# Altium schematic sheet Receiver.SchDoc
size A4; SheetNumber: 1; SheetTotal: 1; SPICEModelCacheURACZJYY: <root> / <DocumentId>URACZJYY</DocumentId> / </root>
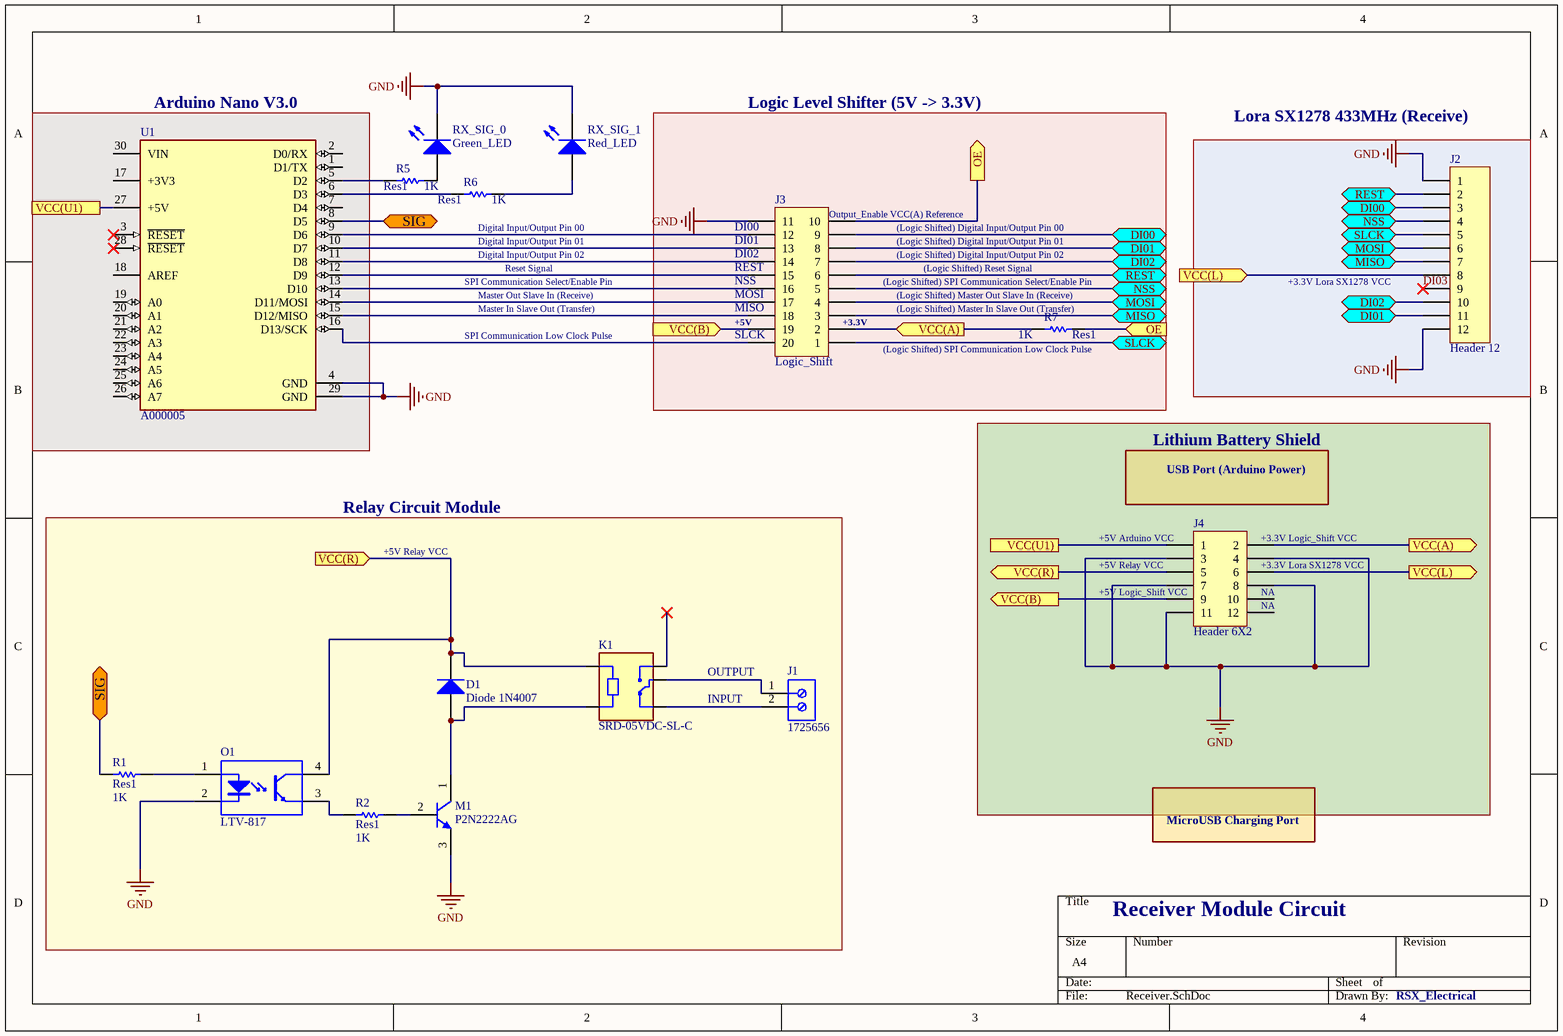
[diagram p0: Receiver.SchDoc]

## Parts
D1  Diode 1N4007  [DO-41]
J1  1725656  [PHOE-1725656-2]
J2  Header 12  [LORA Sx1278]
J3  Logic_Shift  [DIP2SSOP20]
J4  Header 6X2  [3.3V/5V Battery Shield]
K1  SRD-05VDC-SL-C  [RELAY_SRD-05VDC-SL-C]
M1  P2N2222AG  [ONSC-TO-92-3-29-11]
O1  LTV-817  [LTST-LTV-817-4]
R1  Res1  value 1K  [AXIAL-0.3]
R2  Res1  value 1K  [AXIAL-0.3]
R5  Res1  value 1K  [AXIAL-0.3]
R6  Res1  value 1K  [AXIAL-0.3]
R7  Res1  value 1K  [AXIAL-0.3]
RX_SIG_0  Green_LED  [LED-0]
RX_SIG_1  Red_LED  [LED-0]
U1  A000005  [FP-A000005-MFG]

## Blocks framed on the sheet
Arduino Nano V3.0: U1
Logic Level Shifter (5V -> 3.3V): J3 R7
Lora SX1278 433MHz (Receive): J2
Lithium Battery Shield: J4
Relay Circuit Module: D1 J1 K1 M1 O1 R1 R2

## Ports
DI00 (bidir), DI01 (bidir), DI02 (bidir), MISO (bidir), MOSI (bidir), NSS (bidir), OE (in), OE (out), REST (bidir), SIG (bidir), SLCK (bidir), VCC(A) (in), VCC(A) (out), VCC(B) (in), VCC(B) (out), VCC(L) (in), VCC(L) (out), VCC(R) (in), VCC(R) (out), VCC(U1)

## Nets
GND: J2.1 J2.12 J3.11 J4.3 J4.4 J4.7 J4.8 J4.11 M1.3(E) O1.2(CATHODE) RX_SIG_0.2(K) RX_SIG_1.2(K) U1.4(GND) U1.29(GND)
DI00: J2.3 J3.9 ; port DI00
DI01: J2.11 J3.8 ; port DI01
DI02: J2.10 J3.7 ; port DI02
DI03: J2.9
MISO: J2.7 J3.3 ; port MISO
MOSI: J2.6 J3.4 ; port MOSI
NSS: J2.4 J3.5 ; port NSS
OE: J3.10 R7.1 ; port OE
REST: J2.2 J3.6 ; port REST
SIG: R1.2 U1.8(D5) ; port SIG
SLCK: J2.5 J3.1 ; port SLCK
VCC(A): J3.2 J4.2 R7.2 ; port VCC(A)
VCC(B): J3.19 J4.9 ; port VCC(B)
VCC(L): J2.8 J4.6 ; port VCC(L)
VCC(R): D1.2(K) J4.5 K1.A1 O1.4(COLLECTOR) ; port VCC(R)
VCC(U1): J4.1 U1.27(+5V) ; port VCC(U1)
NetD1_1: D1.1(A) K1.A2 M1.1(C)
NetJ1_1: J1.1 K1.COM
NetJ1_2: J1.2 K1.NC
NetJ3_12: J3.12 U1.9(D6)
NetJ3_13: J3.13 U1.10(D7)
NetJ3_14: J3.14 U1.11(D8)
NetJ3_15: J3.15 U1.12(D9)
NetJ3_16: J3.16 U1.13(D10)
NetJ3_17: J3.17 U1.14(D11/MOSI)
NetJ3_18: J3.18 U1.15(D12/MISO)
NetJ3_20: J3.20 U1.16(D13/SCK)
NetM1_2: M1.2(B) R2.2
NetO1_1: O1.1(ANODE) R1.1
NetO1_3: O1.3(EMITTER) R2.1
NetR5_1: R5.1 RX_SIG_0.1(A)
NetR5_2: R5.2 U1.5(D2)
NetR6_1: R6.1 RX_SIG_1.1(A)
NetR6_2: R6.2 U1.6(D3)

Not connected (* = marked no-connect by the designer): J4 10 12; K1 NO*; U1 1(D1/TX) 2(D0/RX) 3(~{RESET})* 7(D4) 17(+3V3) 18(AREF) 19(A0) 20(A1) 21(A2) 22(A3) 23(A4) 24(A5) 25(A6) 26(A7) 28(~{RESET})* 30(VIN)

## Notes on the sheet
- (near R6) Digital Input/Output Pin 00
- (near R6) Digital Input/Output Pin 01
- (near J3) DI00
- (near J3) DI01
- (near J3) Output_Enable VCC(A) Reference
- (Logic Shifted) Digital Input/Output Pin 00
- (Logic Shifted) Digital Input/Output Pin 01
- SPI Communication Select/Enable Pin
- Digital Input/Output Pin 02
- Master Out Slave In (Receive)
- Master In Slave Out (Transfer)
- Reset Signal
- (near J3) DI02
- (near J3) REST
- (near J3) NSS
- (near J3) MOSI
- (near J3) MISO
- (Logic Shifted) SPI Communication Select/Enable Pin
- (Logic Shifted) Digital Input/Output Pin 02
- (near R7) (Logic Shifted) Master Out Slave In (Receive)
- (near R7) (Logic Shifted) Master In Slave Out (Transfer)
- (Logic Shifted) Reset Signal
- +3.3V Lora SX1278 VCC
- SPI Communication Low Clock Pulse
- (near J3) +5V
- (near J3) SLCK
- (near J3) +3.3V
- (near R7) (Logic Shifted) SPI Communication Low Clock Pulse
- USB Port (Arduino Power)
- +5V Relay VCC
- (near J4) +5V Relay VCC
- (near J4) +5V Arduino VCC
- (near J4) +3.3V Logic_Shift VCC
- (near J4) +3.3V Lora SX1278 VCC
- (near J4) +5V Logic_Shift VCC
- (near J4) NA
- INPUT
- OUTPUT
- MicroUSB Charging Port
- Receiver Module Circuit
- RSX_Electrical

## Library data of the parts
D1 = Diode 1N4007: 1 Amp General Purpose Rectifier; Published: 8-Jun-2000; LatestRevisionDate: 17-Jul-2002; LatestRevisionNote: Re-released for DXP Platform.; DatasheetVersion: 1998; PackageVersion: Aug-1999; PackageReference: DO-41; Publisher: Altium Limited; PackageDescription: Diode, Axial; Body 5.2 x 2.7 mm (LxDia. max), Lead Dia. 0.86 mm (max); Code_JEDEC: DO-204-AL; ComponentLink1Description: Manufacturer Link; ComponentLink1URL: http://www.fairchildsemi.com/; ComponentLink2Description: Datasheet; ComponentLink2URL: http://www.fairchildsemi.com/ds/1N%2F1N4001.pdf
J1 = CMP-2000-05299-1: Male Header, Pitch 2.54 mm, 1 x 2 Position, Height 9 mm, Tail Length 3.5 mm; Manufacturer: Phoenix Contact; Number of contacts: 2; Content: 250pc(s); Pitch: 2.54mm; Industrial packaging: Yes; Colour: Green; Manufacturer part No.: 1725656; Type: MPT0,5/2-2,54; Datasheet URL: http://datasheet.octopart.com/1725656-Phoenix-Contact-datasheet-5302866.pdf; Manufacturer URL: http://www.phoenixcontact.com/; Datasheet Version: Apr-08
J2 = Header 12: Header, 12-Pin; LatestRevisionDate: 17-Jul-2002; LatestRevisionNote: Re-released for DXP Platform.; Publisher: Altium Limited
J3 = Header 10X2: Header, 10-Pin, Dual row; LatestRevisionDate: 17-Jul-2002; LatestRevisionNote: Re-released for DXP Platform.; Publisher: Altium Limited
J4 = Header 6X2: Header, 6-Pin, Dual row; LatestRevisionDate: 17-Jul-2002; LatestRevisionNote: Re-released for DXP Platform.; Publisher: Altium Limited
K1 = SRD-05VDC-SL-C: 5V Trigger Relay Module For Arduino And Raspberry Pi 5V Trigger Relay Module For Arduino And Raspberry Pi; MF: Songle Relay; Value: *; Price: None; Package: NON STANDARD-5 Songle Relay; Availability: Not in stock; Check_prices: https://www.snapeda.com/parts/SRD-05VDC-SL-C/Songle+Relay/view-part/?ref=eda; MP: SRD-05VDC-SL-C; SnapEDA_Link: https://www.snapeda.com/parts/SRD-05VDC-SL-C/Songle+Relay/view-part/?ref=snap
M1 = CMP-1048-01402-1: Amplifier Transistor, NPN Silicon, 3-Pin TO-92, Pb-Free, Bulk Box; Manufacturer: On Semiconductor; IC Continuous (A): 0.6; fT Min (MHz): 300; ComponentLink2Description: Datasheet; ComponentLink1Description: Manufacturer URL; ComponentLink2URL: http://www.onsemi.com/pub_link/Collateral/P2N2222A-D.PDF; ComponentLink3Description: Package Specification; RoHS: TRUE; ComponentLink1URL: http://www.onsemi.com/; PartNumber: P2N2222AG; Mounting Technology: Through Hole; PackageReference: TO-92-3-29-11_AM_SL; Polarity: NPN; Packing: Bulk Box; DatasheetVersion: Rev. 7; PackageDescription: 3-Pin Transistor Outline, Body 4.825 x 3.685 mm, Pitch 1.27 mm; PackageVersion: Rev. AM; ComponentLink3URL: http://www.onsemi.cn/pub_link/Collateral/2N6426-D.PDF
O1 = CMP-2000-06632-1: Photocoupuler, 50 mA Forward Current, 1.2 V Forward Voltage, -50 to 110 degC, 4-Pin DIP, RoHS, Tube; Manufacturer: Lite-On; Maximum Fall Time: 18us; Maximum Collector Emitter Saturation Voltage: 200mV; Maximum Forward Voltage: 1.4V; Typical Rise Time: 4us; Maximum Collector Current: 50mA; Maximum Collector Emitter Voltage: 35V; Product Length: 4.6mm; Maximum Reverse Voltage: 6V; Minimum Isolation Voltage: 5000Vrms; Number of Channels per Chip: 1; Typical Fall Time: 3us; Product Width: 6.5mm; Minimum Current Transfer Ratio: 50%; Output Type: DC; Output Device: Transistor; Maximum Current Transfer Ratio: 600%; Pin_Count: 4; Product Height: 3.5mm; Maximum Power Dissipation: 200mW; Typical Forward Voltage: 1.2V; Package Reference: LTV-817; Datasheet URL: http://optoelectronics.liteon.com/upload/download/DS70-2012-0050/S_110_LTV-8X7%20series%200915.pdf; Family: LTV817; Package Description: 4-Pin Double In-line Package, Body 6.5 x 4.6 mm, Pitch 2.54 mm; Maximum Rise Time: 18us; Product Type: TransistorandPhotovoltaicOutputPhotoCouplers; Supplier_Package: PDIP; Mounting: ThroughHole; Minimum Operating Temperature: -30C; Manufacturer URL: http://www.us.liteon.com/; Datasheet Version: Rev. E, 10/2015; Mounting Technology: ThroughHole; Maximum Operating Temperature: 100C; Input Type: DC; Maximum Input Current: 50mA
R1 R2 R5-R7 = Res1: Resistor; Published: 8-Jun-2000; LatestRevisionDate: 17-Jul-2002; LatestRevisionNote: Re-released for DXP Platform.; PackageReference: AXIAL-0.3; Publisher: Altium Limited; PackageDescription: Axial Device, Thru-Hole; 2 Leads; 0.3 in Pin Spacing
RX_SIG_0 RX_SIG_1 = LED0: Typical INFRARED GaAs LED; Published: 8-Jun-2000; LatestRevisionDate: 08-Jul-2005; LatestRevisionNote: Mech Layer 1 removed.; PackageReference: LED-0; Publisher: Altium Limited; PackageDescription: LED; 2 Leads
U1 = CMP-189986-000002-1: ARDUINO NANO ATMEGA328 EVAL BRD; Number of Bits: 8; Evaluation Kit: Yes; Operating Supply Voltage: 12V; Interface: I2C; Data Bus Width: 8b; Core Architecture: AVR; Packaging: Bulk; Length: 7inch; Package Quantity: 50; Width: 5inch; REACH SVHC: No SVHC; Weight: 0.358383oz; Series: AVR® ATmega; Height: 0.25inch